# Altium schematic sheet Bootcamp Schematic.SchDoc
size A4; SheetNumber: 1; SheetTotal: 1
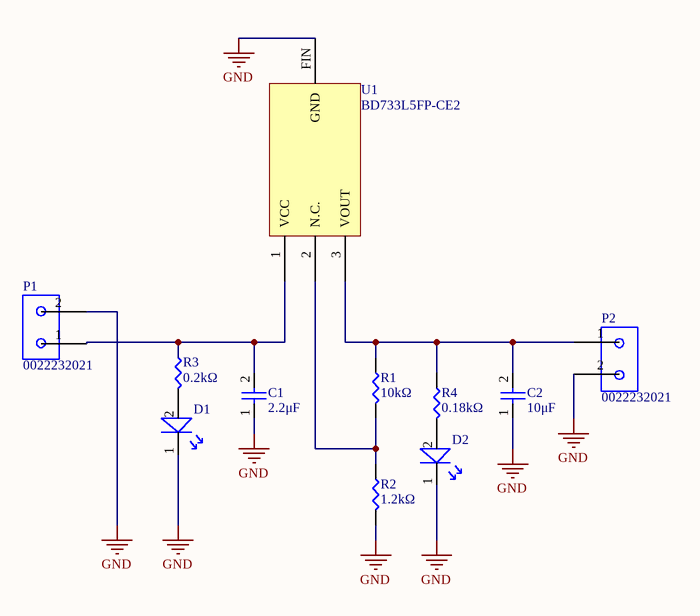
[diagram p0: Bootcamp Schematic.SchDoc]

## Parts
C1  value 2.2μF  [CAP0201 (0603 Metric)]  (hidden comment: GRM033R60G225ME44D)
C2  value 10μF  [CAP0805 (2012 Metric)]  (hidden comment: GRM21BR70J106KA73K)
D1  SML-D12M1WT86  [LED0603Y]  (value not drawn)
D2  SML-D12M1WT86  [LED0603Y]  (value not drawn)
P1  0022232021  [CON2.54mm]
P2  0022232021  [CON2.54mm]
R1  value 10kΩ  [RES0402 (1005 Metric)]  (hidden comment: AC0402FR-0710KL)
R2  value 1.2kΩ  [RES0402 (1005 Metric)]  (hidden comment: RC0402JR-071K2L)
R3  value 0.2kΩ  [RES0402 (1005 Metric)]  (hidden comment: RC0402FR-07200RL)
R4  value 0.18kΩ  [RES0402 (1005 Metric)]  (hidden comment: RC0402FR-07180RL)
U1  BD733L5FP-CE2  [TO-252-3, DPak (2 Leads + Tab), SC-63]

## Nets
GND: C1.1 C2.1 D1.1 D2.1 P1.2 P2.2 R2.1 U1.FIN(GND)
NetC1_2: C1.2 P1.1 R3.2 U1.1(VCC)
NetC2_2: C2.2 P2.1 R1.2 R4.2 U1.3(VOUT)
NetR1_1: R1.1 R2.2 U1.2(N.C.)

Not connected (* = marked no-connect by the designer): D1 2; D2 2; R3 1; R4 1

## Library data of the parts
C1 = GRM033R60G225ME44D: CAP CER 2.2UF 4V X5R 0201; Manufacturer 1: Murata; Supplier 1: Digi-Key; Manufacturer Part Number 1: GRM033R60G225ME44D; Supplier Part Number 1: 490-13221-2-ND; Voltage Rating: 4V
C2 = GRM21BR70J106KA73K: CAP CER 10UF 6.3V X7R 0805; Manufacturer 1: Murata; Supplier 1: Digi-Key; Manufacturer Part Number 1: GRM21BR70J106KA73K; Supplier Part Number 1: 490-GRM21BR70J106KA73KTR-ND; Voltage Rating: 6.3V
D1 D2 = SML-D12M1WT86: LED YLW/GREEN DIFFUSED 1608 SMD; Manufacturer 1: Rohm Semiconductor; Forward Voltage: 2.2V; Forward Current: 20mA; Manufacturer Part Number 1: SML-D12M1WT86; Supplier 1: Digi-Key; Supplier Part Number 1: SML-D12M1WT86TR-ND
P1 P2 = 0022232021: CONN HEADER VERT 2POS 2.54MM; Manufacturer 1: Molex; Supplier 1: Digi-Key; Supplier Part Number 1: 900-0022232021-ND; Mating Pitch: 2.54mm; Manufacturer Part Number 1: 0022232021
R1 = AC0402FR-0710KL: RES SMD 10K OHM 1% 1/16W 0402; Manufacturer 1: YAGEO; Manufacturer Part Number 1: AC0402FR-0710KL; Supplier Part Number 1: YAG3436TR-ND; Supplier 1: Digi-Key; Power Rating: 1/16W
R2 = RC0402JR-071K2L: RES 1.2K OHM 5% 1/16W 0402 /; Manufacturer 1: YAGEO; Manufacturer Part Number 1: RC0402JR-071K2L; Supplier Part Number 1: 311-1.2KJRTR-ND; Supplier 1: Digi-Key; Power Rating: 1/16W
R3 = RC0402FR-07200RL: RES 200 OHM 1% 1/16W 0402 /; Manufacturer 1: YAGEO; Manufacturer Part Number 1: RC0402FR-07200RL; Supplier Part Number 1: 311-200LRTR-ND; Supplier 1: Digi-Key; Power Rating: 1/16W
R4 = RC0402FR-07180RL: RES 180 OHM 1% 1/16W 0402 /; Manufacturer 1: YAGEO; Manufacturer Part Number 1: RC0402FR-07180RL; Supplier Part Number 1: 311-180LRTR-ND; Supplier 1: Digi-Key; Power Rating: 1/16W
U1 = BD733L5FP-CE2: IC REG LINEAR 3.3V 500MA TO252-3; Manufacturer 1: *; Manufacturer Part Number 1: *; Supplier 1: *; Supplier Part Number 1: *